# Altium schematic sheet DAC8552_yusnows.SchDoc
size A4
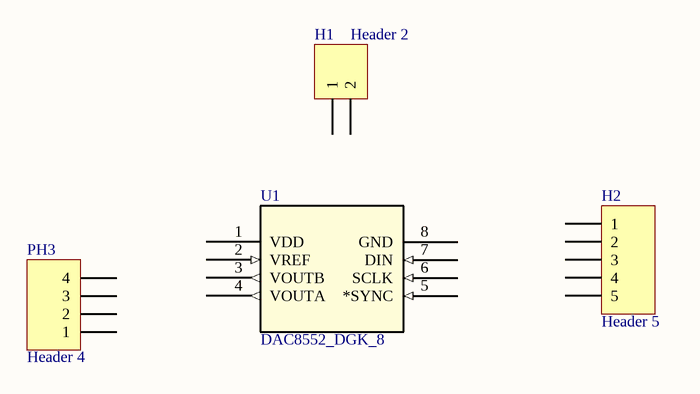
[diagram p0: DAC8552_yusnows.SchDoc]

## Parts
H1  Header 2  [HDR1X2]
H2  Header 5  [HDR1X5]
PH3  Header 4  [HDR1X4]
U1  DAC8552_DGK_8  [DGK8]

## Nets

Not connected (* = marked no-connect by the designer): H1 1 2; H2 1 2 3 4 5; PH3 1 2 3 4; U1 1(VDD) 2(VREF) 3(VOUTB) 4(VOUTA) 5(*SYNC) 6(SCLK) 7(DIN) 8(GND)

## Library data of the parts
H1 = Header 2: Header, 2-Pin; LatestRevisionDate: 17-Jul-2002; LatestRevisionNote: Re-released for DXP Platform.; Publisher: Altium Limited
H2 = Header 5: Header, 5-Pin; LatestRevisionDate: 17-Jul-2002; LatestRevisionNote: Re-released for DXP Platform.; Publisher: Altium Limited
PH3 = Header 4: Header, 4-Pin; LatestRevisionDate: 17-Jul-2002; LatestRevisionNote: Re-released for DXP Platform.; Publisher: Altium Limited
U1 = DAC8552_DGK_8: Imported; Manufacturer: Texas Instruments; INDUSTRY_STD_PKG_TYPE: MSOP; FAMILY_NAME: PRECISION DAC (=<10MSPS); PIN_COUNT: 8; PACKAGE_DESIGNATOR: DGK; Datasheet_URL: http://www.ti.com/lit/gpn/DAC8552; GENERIC_PART_NUMBER: DAC8552; Vendor: Texas Instruments; Manufacturer_Part_Number: dac8552_dgk_8; Value: Value; Type: Type; RefDes: RefDes